# Altium schematic sheet power-v3.6.SchDoc
size A4; SheetNumber: 1
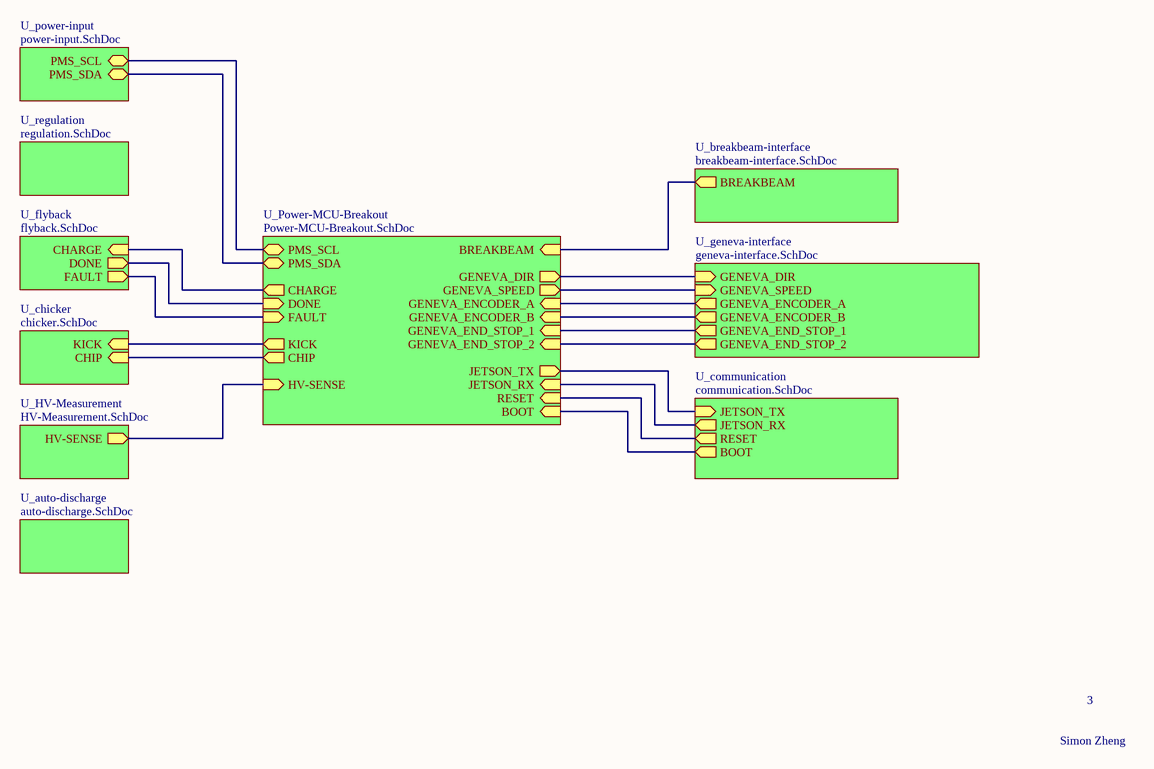
[diagram p0: power-v3.6.SchDoc]

## Sub-sheets
U_auto-discharge = auto-discharge.SchDoc: no entries
U_breakbeam-interface = breakbeam-interface.SchDoc: BREAKBEAM (out)
U_chicker = chicker.SchDoc: CHIP (in), KICK (in)
U_communication = communication.SchDoc: JETSON_TX (in), JETSON_RX (out), RESET (out), BOOT (out)
U_flyback = flyback.SchDoc: CHARGE (in), FAULT (out), DONE (out)
U_geneva-interface = geneva-interface.SchDoc: GENEVA_SPEED (in), GENEVA_ENCODER_A (out), GENEVA_ENCODER_B (out), GENEVA_DIR (in), GENEVA_END_STOP_1 (out), GENEVA_END_STOP_2 (out)
U_HV-Measurement = HV-Measurement.SchDoc: HV-SENSE (out)
U_power-input = power-input.SchDoc: PMS_SDA (bidir), PMS_SCL (bidir)
U_Power-MCU-Breakout = Power-MCU-Breakout.SchDoc: GENEVA_END_STOP_1 (in), GENEVA_END_STOP_2 (in), HV-SENSE (in), BREAKBEAM (in), FAULT (in), DONE (in), CHARGE (out), GENEVA_DIR (out), JETSON_TX (out), JETSON_RX (in), GENEVA_ENCODER_A (in), GENEVA_ENCODER_B (in), GENEVA_SPEED (out), KICK (out), CHIP (out), PMS_SCL (bidir), PMS_SDA (bidir), BOOT (in), RESET (in)
U_regulation = regulation.SchDoc: no entries

## Nets
(unnamed): sheet U_breakbeam-interface/BREAKBEAM, sheet U_Power-MCU-Breakout/BREAKBEAM
(unnamed): sheet U_chicker/CHIP, sheet U_Power-MCU-Breakout/CHIP
(unnamed): sheet U_chicker/KICK, sheet U_Power-MCU-Breakout/KICK
(unnamed): sheet U_communication/JETSON_TX, sheet U_Power-MCU-Breakout/JETSON_TX
(unnamed): sheet U_communication/JETSON_RX, sheet U_Power-MCU-Breakout/JETSON_RX
(unnamed): sheet U_communication/RESET, sheet U_Power-MCU-Breakout/RESET
(unnamed): sheet U_communication/BOOT, sheet U_Power-MCU-Breakout/BOOT
(unnamed): sheet U_flyback/CHARGE, sheet U_Power-MCU-Breakout/CHARGE
(unnamed): sheet U_flyback/FAULT, sheet U_Power-MCU-Breakout/FAULT
(unnamed): sheet U_flyback/DONE, sheet U_Power-MCU-Breakout/DONE
(unnamed): sheet U_geneva-interface/GENEVA_SPEED, sheet U_Power-MCU-Breakout/GENEVA_SPEED
(unnamed): sheet U_geneva-interface/GENEVA_ENCODER_A, sheet U_Power-MCU-Breakout/GENEVA_ENCODER_A
(unnamed): sheet U_geneva-interface/GENEVA_ENCODER_B, sheet U_Power-MCU-Breakout/GENEVA_ENCODER_B
(unnamed): sheet U_geneva-interface/GENEVA_DIR, sheet U_Power-MCU-Breakout/GENEVA_DIR
(unnamed): sheet U_geneva-interface/GENEVA_END_STOP_1, sheet U_Power-MCU-Breakout/GENEVA_END_STOP_1
(unnamed): sheet U_geneva-interface/GENEVA_END_STOP_2, sheet U_Power-MCU-Breakout/GENEVA_END_STOP_2
(unnamed): sheet U_HV-Measurement/HV-SENSE, sheet U_Power-MCU-Breakout/HV-SENSE
(unnamed): sheet U_power-input/PMS_SDA, sheet U_Power-MCU-Breakout/PMS_SDA
(unnamed): sheet U_power-input/PMS_SCL, sheet U_Power-MCU-Breakout/PMS_SCL

## Notes on the sheet
- 3
- Simon Zheng